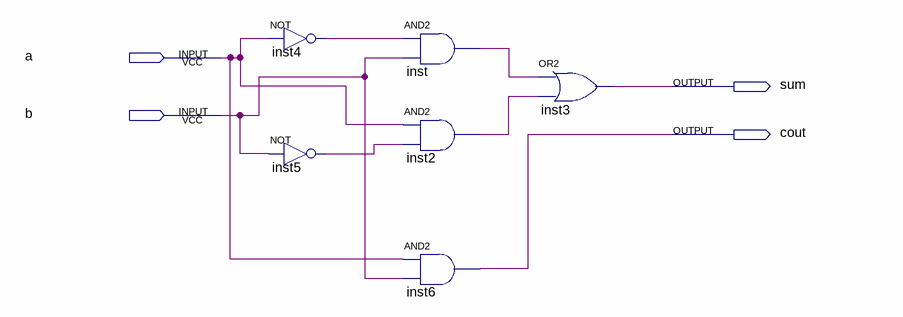
[diagram p0: schematic sheet]
// Quartus schematic Block_logic_gates.bdf as structural Verilog: 6 symbols, 4 pins
module Block_logic_gates (
  input  a,
  input  b,
  output sum,
  output cout
);

  wire inst2_out, inst4_out, inst5_out, inst_out;

  not inst4 (inst4_out, a);
  not inst5 (inst5_out, b);
  and inst (inst_out, inst4_out, b);
  and inst2 (inst2_out, a, inst5_out);
  and inst6 (cout, a, b);
  or inst3 (sum, inst_out, inst2_out);
endmodule
